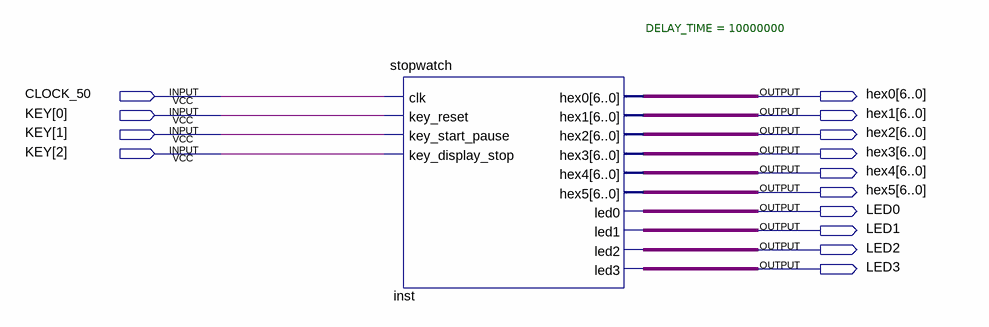
[diagram p0: schematic sheet]
// Quartus schematic Lab1_Stopwatch.bdf as structural Verilog: 1 symbols, 14 pins
module Lab1_Stopwatch (
  input  CLOCK_50,
  input  [2:0] KEY,
  output [6:0] hex0,
  output [6:0] hex1,
  output [6:0] hex2,
  output [6:0] hex3,
  output [6:0] hex4,
  output [6:0] hex5,
  output LED0,
  output LED1,
  output LED2,
  output LED3
);

  stopwatch #(.DELAY_TIME(10000000)) inst (
    .clk(CLOCK_50), .key_reset(KEY[0]), .key_start_pause(KEY[1]), .key_display_stop(KEY[2]), .hex0(hex0),
    .hex1(hex1), .hex2(hex2), .hex3(hex3), .hex4(hex4), .hex5(hex5), .led0(LED0), .led1(LED1), .led2(LED2),
    .led3(LED3));
endmodule
